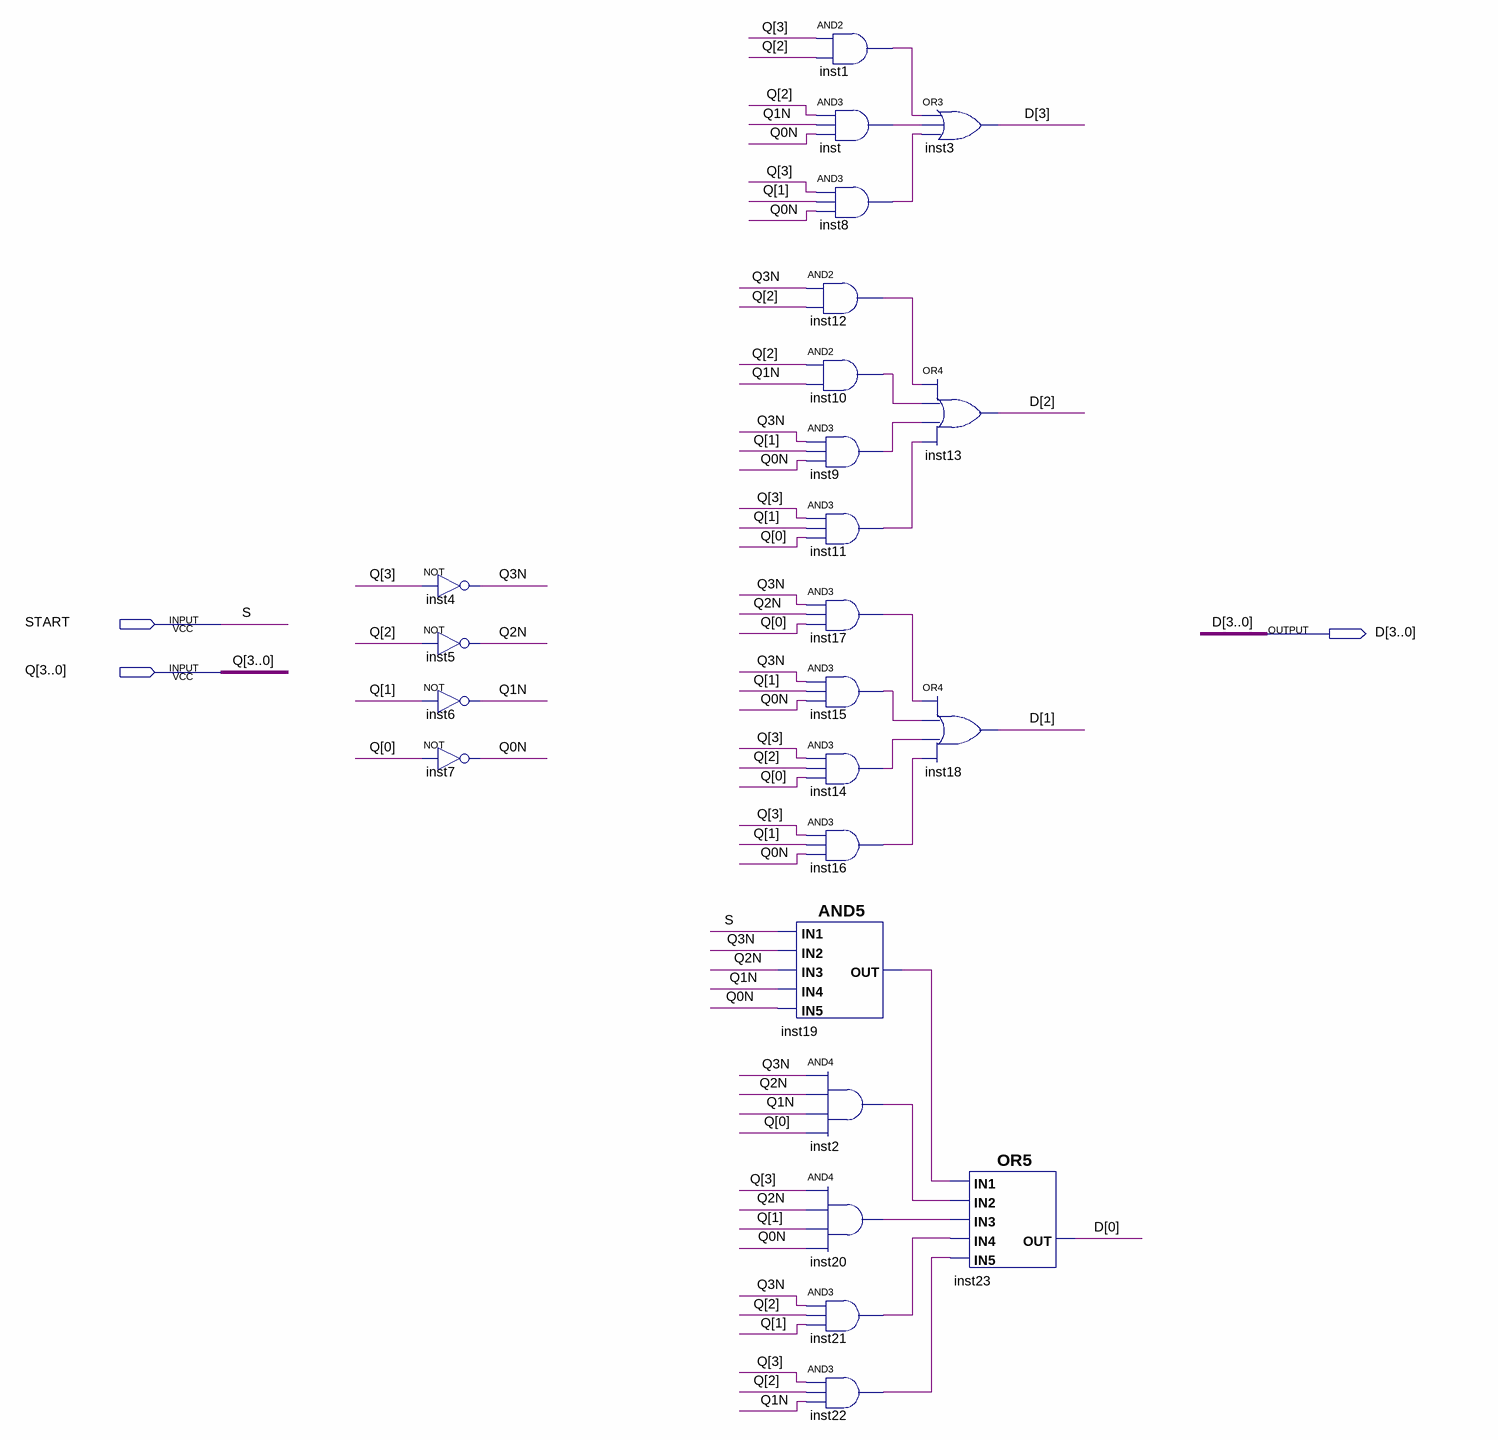
[diagram p0: schematic sheet]
// Quartus schematic NEXT_STATE.bdf as structural Verilog: 24 symbols, 3 pins
module NEXT_STATE (
  input  START,
  input  [3:0] Q,
  output [3:0] D
);

  wire inst1_out, inst2_out, inst8_out, inst9_out, inst10_out, inst11_out, inst12_out, inst14_out,
       inst15_out, inst16_out, inst17_out, inst19_out, inst20_out, inst21_out, inst22_out, inst_out, Q0N,
       Q1N, Q2N, Q3N;

  not inst4 (Q3N, Q[3]);
  not inst5 (Q2N, Q[2]);
  not inst6 (Q1N, Q[1]);
  not inst7 (Q0N, Q[0]);
  and inst1 (inst1_out, Q[3], Q[2]);
  and inst (inst_out, Q[2], Q1N, Q0N);
  and inst8 (inst8_out, Q[3], Q[1], Q0N);
  and inst12 (inst12_out, Q3N, Q[2]);
  and inst10 (inst10_out, Q[2], Q1N);
  and inst9 (inst9_out, Q3N, Q[1], Q0N);
  and inst11 (inst11_out, Q[3], Q[1], Q[0]);
  and inst17 (inst17_out, Q3N, Q2N, Q[0]);
  and inst15 (inst15_out, Q3N, Q[1], Q0N);
  and inst14 (inst14_out, Q[3], Q[2], Q[0]);
  and inst16 (inst16_out, Q[3], Q[1], Q0N);
  and inst19 (inst19_out, START, Q3N, Q2N, Q1N, Q0N);
  and inst2 (inst2_out, Q3N, Q2N, Q1N, Q[0]);
  and inst20 (inst20_out, Q[3], Q2N, Q[1], Q0N);
  and inst21 (inst21_out, Q3N, Q[2], Q[1]);
  and inst22 (inst22_out, Q[3], Q[2], Q1N);
  or inst3 (D[3], inst1_out, inst_out, inst8_out);
  or inst13 (D[2], inst12_out, inst10_out, inst9_out, inst11_out);
  or inst18 (D[1], inst17_out, inst15_out, inst14_out, inst16_out);
  or inst23 (D[0], inst19_out, inst2_out, inst20_out, inst21_out, inst22_out);

  // Other names for the same wires on the sheet: S = START
endmodule
